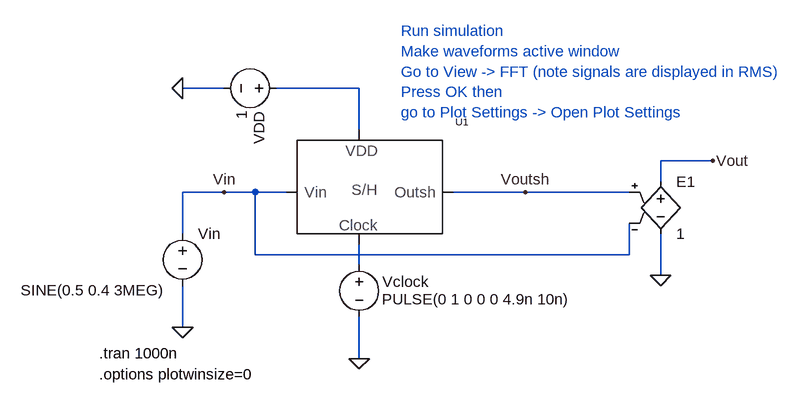
[diagram p0: schematic _Fig5_8_MSD.asc]
_Fig5_8_MSD.asc, the LTspice schematic file:
Version 4
SHEET 1 1428 696
WIRE 352 160 288 160
WIRE 560 160 432 160
WIRE 560 224 560 160
WIRE 1104 272 1024 272
WIRE 1024 304 1024 272
WIRE 352 320 288 320
WIRE 400 320 352 320
WIRE 448 320 400 320
WIRE 816 320 704 320
WIRE 976 320 816 320
WIRE 288 384 288 320
WIRE 400 416 400 320
WIRE 976 416 976 368
WIRE 976 416 400 416
WIRE 560 432 560 400
WIRE 1024 448 1024 384
WIRE 288 528 288 464
WIRE 560 576 560 512
FLAG 288 528 0
FLAG 352 320 Vin
FLAG 288 160 0
FLAG 560 576 0
FLAG 816 320 Voutsh
FLAG 1024 448 0
FLAG 1104 272 Vout
SYMBOL voltage 288 368 R0
WINDOW 123 0 0 Left 0
WINDOW 39 0 0 Left 0
WINDOW 3 -249 103 Left 0
SYMATTR Value SINE(0.5 0.4 3MEG)
SYMATTR InstName Vin
SYMBOL voltage 448 160 R90
WINDOW 0 36 42 Left 0
WINDOW 3 35 69 Left 0
WINDOW 123 0 0 Left 0
WINDOW 39 0 0 Left 0
SYMATTR InstName VDD
SYMATTR Value 1
SYMBOL voltage 560 416 R0
WINDOW 0 36 42 Left 0
WINDOW 3 35 69 Left 0
WINDOW 123 0 0 Left 0
WINDOW 39 0 0 Left 0
SYMATTR InstName Vclock
SYMATTR Value PULSE(0 1 0 0 0 4.9n 10n)
SYMBOL Sample_and_hold 464 384 R0
SYMATTR InstName U1
SYMBOL e 1024 288 R0
SYMATTR InstName E1
SYMATTR Value 1
TEXT 160 568 Left 0 !.tran 1000n
TEXT 624 72 Left 0 ;Run simulation\nMake waveforms active window\nGo to View -> FFT (note signals are displayed in RMS)\nPress OK then  \ngo to Plot Settings -> Open Plot Settings
TEXT 160 600 Left 0 !.options plotwinsize=0

The netlist it stands for:
* _Fig5_8_MSD.asc
Vin Vin 0 SINE(0.5 0.4 3MEG)
VDD N001 0 1
Vclock N002 0 PULSE(0 1 0 0 0 4.9n 10n)
XU1 Vin Voutsh N002 N001 Sample_and_hold  ; pins Vin Outsh Clock VDD
E1 Vout 0 Voutsh Vin 1
.tran 1000n
* Run simulation
* Make waveforms active window
* Go to View -> FFT (note signals are displayed in RMS)
* Press OK then
* go to Plot Settings -> Open Plot Settings
.options plotwinsize=0
.backanno
.end